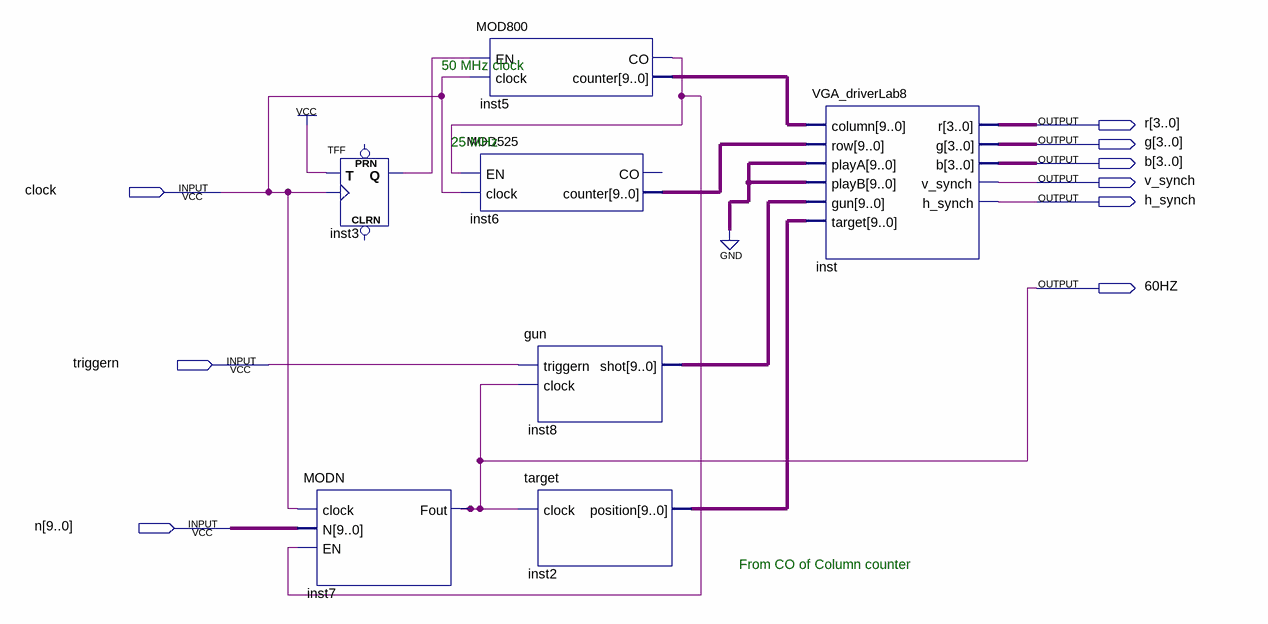
[diagram p0: schematic sheet]
// Quartus schematic system.bdf as structural Verilog: 7 symbols, 9 pins
module system (
  input  clock,
  input  triggern,
  input  [9:0] n,
  output [3:0] r,
  output [3:0] g,
  output [3:0] b,
  output v_synch,
  output h_synch,
  output \60HZ 
);

  wire inst3_q, inst5_co;
  wire [9:0] inst2_position, inst5_counter, inst6_counter, inst8_shot;

  MODN inst7 (.clock(clock), .N(n), .EN(inst5_co), .Fout(\60HZ ));
  TFF inst3 (.T(1'b1), .CLK(clock), .Q(inst3_q));  // open: PRN, CLRN
  MOD800 inst5 (.EN(inst3_q), .clock(clock), .CO(inst5_co), .counter(inst5_counter));
  MOD525 inst6 (.EN(inst5_co), .clock(clock), .counter(inst6_counter));  // open: CO
  gun inst8 (.triggern(triggern), .clock(\60HZ ), .shot(inst8_shot));
  target inst2 (.clock(\60HZ ), .position(inst2_position));
  VGA_driverLab8 inst (
    .column(inst5_counter), .row(inst6_counter), .playA({10{1'b0}}), .playB({10{1'b0}}), .gun(inst8_shot),
    .target(inst2_position), .r(r), .g(g), .b(b), .v_synch(v_synch), .h_synch(h_synch));

  // Notes on the sheet:
  //   50 MHz clock
  //   25 MHz 
  //   From CO of Column counter
endmodule
